# EAGLE design datalogger (EAGLE 9.6.2)
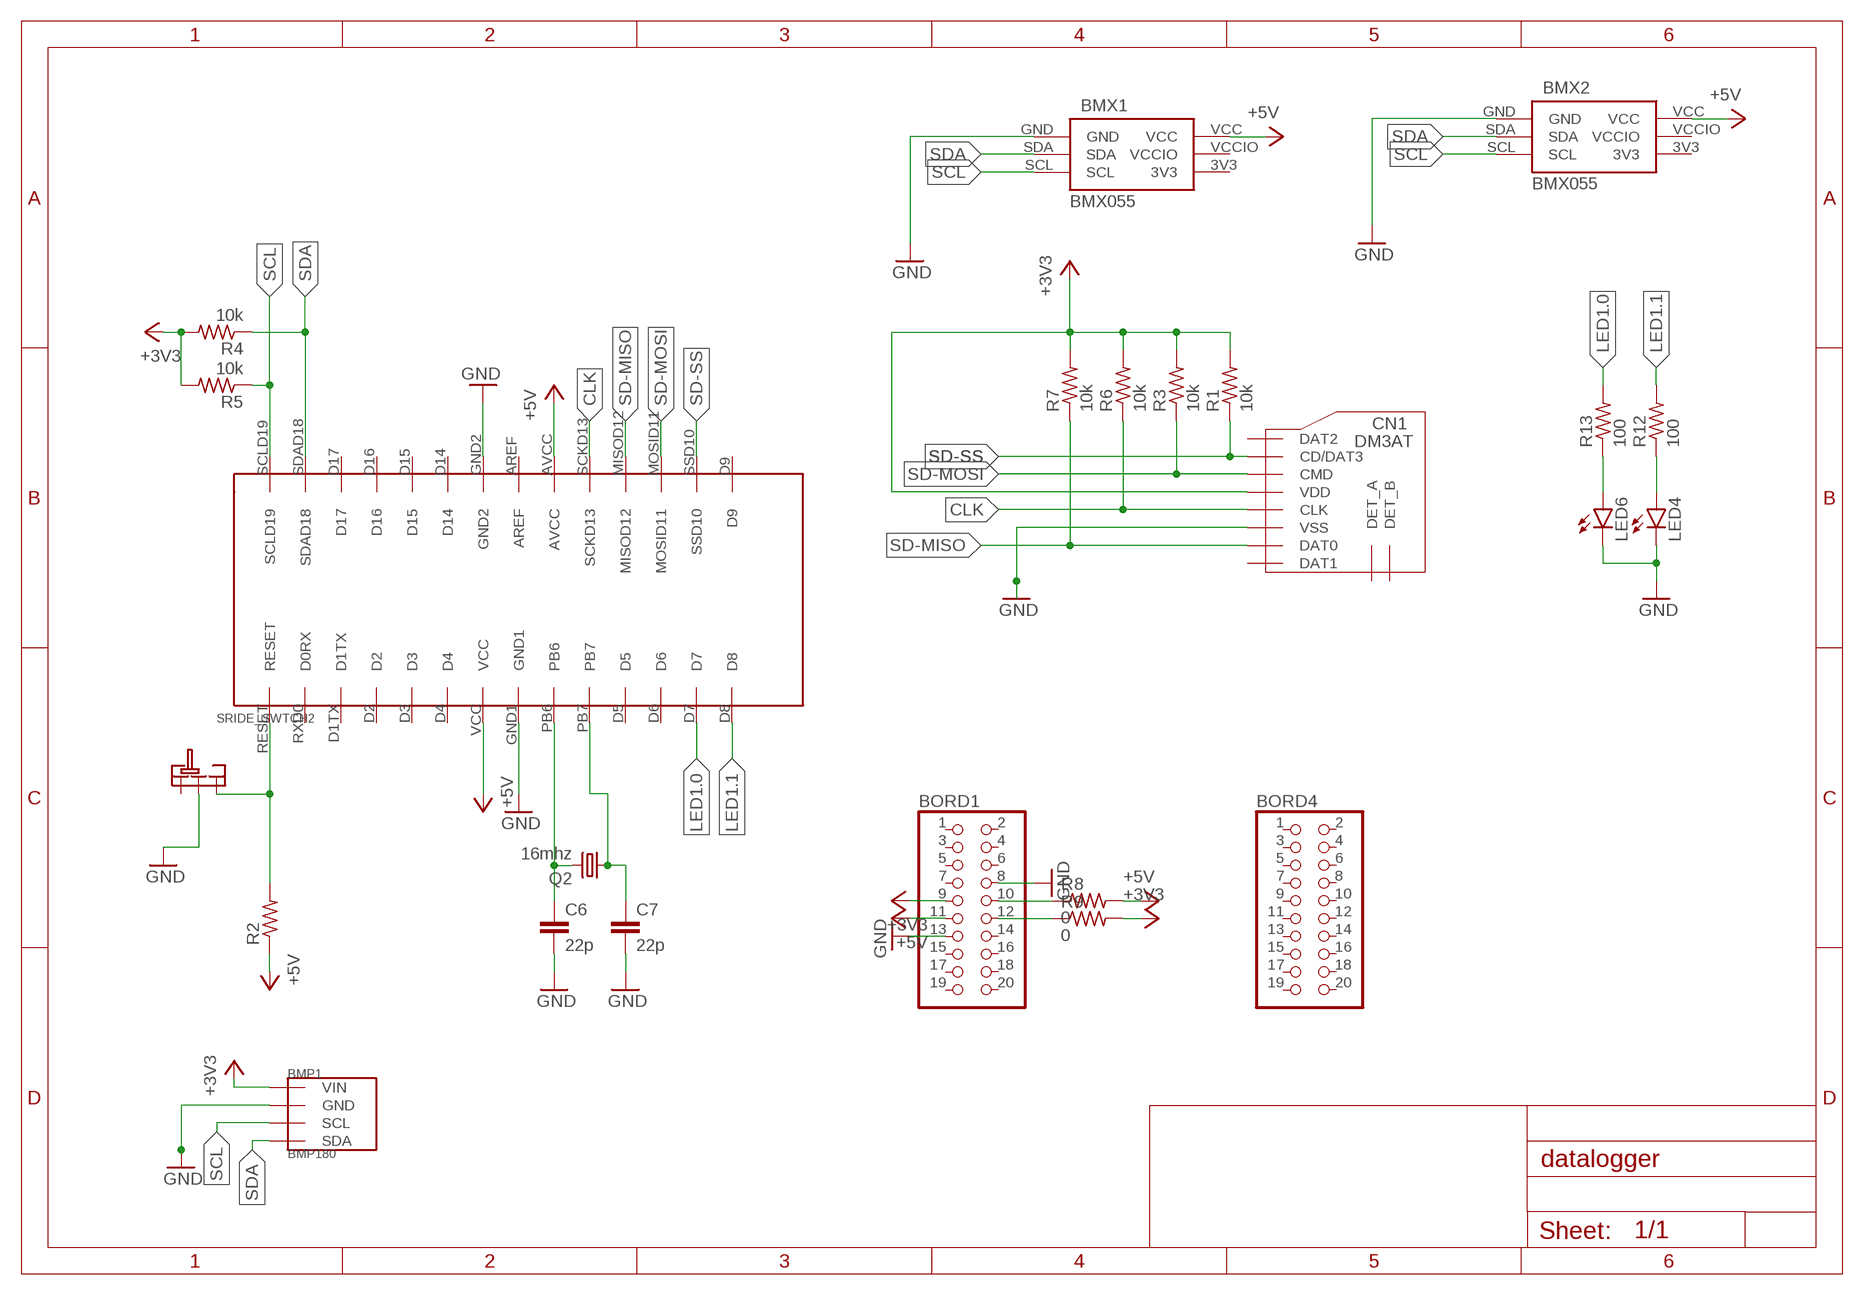
[diagram p0: schematic, sheet 1]

## Parts
BMP1  BMP180  [GY-68]
BMX1  BMX055  [BMX055]
BMX2  BMX055  [BMX055]
BORD1  PINHD-2X10/90  [2X10/90]
BORD4  PINHD-2X10/90  [2X10/90]
C6  22p  C-EU025-024X044  [C025-024X044]
C7  22p  C-EU025-024X044  [C025-024X044]
CN1  DM3AT  [DM3AT]
LED4  LED5MM  [LED5MM]
LED6  LED5MM  [LED5MM]
Q2  16mhz  CRYSTALHC49S  [HC49/S]
R1  10k  R-US_0204/7  [0204/7]
R2  R-US_0204/7  [0204/7]
R3  10k  R-US_0204/7  [0204/7]
R4  10k  R-US_0204/7  [0204/7]
R5  10k  R-US_0204/7  [0204/7]
R6  10k  R-US_0204/7  [0204/7]
R7  10k  R-US_0204/7  [0204/7]
R8  0  R-US_0204/7  [0204/7]
R9  0  R-US_0204/7  [0204/7]
R12  100  R-US_0204/7  [0204/7]
R13  100  R-US_0204/7  [0204/7]
SRIDE_SWTCH2  SRIDE_SWITCH  [SRIDE_SWITCH]
U$6  ATMEGA238P  [ATMEGA328P]

## Nets
+3V3 [POWER_L]: BMP1.P1(VIN) BORD1.9 CN1.VDD R1.2 R3.2 R4.2 R5.2 R6.2 R7.2 R9.2
+5V [POWER_H]: BMX1.VCC BMX2.VCC BORD1.11 R2.1 R8.2 U$6.AVCC U$6.VCC
CLK [SIGNAL]: CN1.CLK R6.1 U$6.SCKD13
GND [GND]: BMP1.P2(GND) BMX1.GND BMX2.GND BORD1.8 BORD1.13 C6.2 C7.2 CN1.VSS LED4.K(C) LED6.K(C) SRIDE_SWTCH2.LR U$6.GND1 U$6.GND2
LED1.0 [SIGNAL]: R13.2 U$6.D7
LED1.1 [SIGNAL]: R12.2 U$6.D8
N$1 [SIGNAL]: LED6.A R13.1
N$2 [SIGNAL]: C6.1 Q2.2 U$6.PB6
N$4 [SIGNAL]: C7.1 Q2.1 U$6.PB7
N$6 [SIGNAL]: BORD1.10 R8.1
N$7 [SIGNAL]: LED4.A R12.1
N$8 [SIGNAL]: R2.2 SRIDE_SWTCH2.R U$6.RESET
N$9 [SIGNAL]: BORD1.12 R9.1
SCL [SIGNAL]: BMP1.P3(SCL) BMX1.SCL BMX2.SCL R5.1 U$6.SCLD19
SD-MISO [SIGNAL]: CN1.DAT0 R7.1 U$6.MISOD12
SD-MOSI [SIGNAL]: CN1.CMD R3.1 U$6.MOSID11
SD-SS [SIGNAL]: CN1.CD/DAT3 R1.1 U$6.SSD10
SDA [SIGNAL]: BMP1.P4(SDA) BMX1.SDA BMX2.SDA R4.1 U$6.SDAD18
Unconnected: BORD1.1 BORD1.2 BORD1.3 BORD1.4 BORD1.5 BORD1.6 BORD1.7 BORD1.14 BORD1.15 BORD1.16 BORD1.17 BORD1.18 BORD1.19 BORD1.20 BORD4.1 BORD4.2 BORD4.3 BORD4.4 BORD4.5 BORD4.6 BORD4.7 BORD4.8 BORD4.9 BORD4.10 BORD4.11 BORD4.12 BORD4.13 BORD4.14 BORD4.15 BORD4.16 BORD4.17 BORD4.18 BORD4.19 BORD4.20 CN1.DAT1 CN1.DAT2 CN1.DET_A CN1.DET_B SRIDE_SWTCH2.L U$6.AREF U$6.D1TX U$6.D2 U$6.D3 U$6.D4 U$6.D5 U$6.D6 U$6.D9 U$6.D14 U$6.D15 U$6.D16 U$6.D17 U$6.RXD0(D0RX)

## Power pins joined to a net without a drawn wire
3V3: BMX1.3V3 BMX2.3V3
VCCIO: BMX1.VCCIO BMX2.VCCIO

## Library data of the parts
BMP1 = BMP180:BMP180
BMX1 BMX2 = BMX055:BMX055
BORD1 BORD4 = pinhead:PINHD-2X10: PIN HEADER
C6 C7 = rcl:C-EU: CAPACITOR, European symbol; SPICEPREFIX: C
CN1 = microSD:DM3AT
LED4 LED6 = led:LED: LED OSRAM: - CHIPLED LG R971, LG N971, LY N971, LG Q971, LY Q971, LO R971, LY R971 LH N974, LH R974 LS Q976, LO Q976, LY Q976 LO Q996 - Hyper CHIPLED LW Q18S LB Q993, LB Q99A, LB R99A - SideLED LS A670, LO A670, LY A670, LG A670, LP A670 LB A673, LV A673, LT A673, LW A673 LH A674 LY A675 LS A676, LA A676, LO A676, LY A676, LW A676 LS A679, LY A679, LG A679 - Hyper Micro SIDELED® LS Y876, LA Y876, LO Y876, LY Y876 LT Y87S - SmartLED LW L88C, LW L88S LB L89C, LB L89S, LG L890 LS L89K, LO L89K, LY L89K LS L896, LA L896, LO L896, LY L896 - TOPLED LS T670, LO T670, LY T670, LG T670, LP T670 LSG T670, LSP T670, LSY T670, LOP T670, LYG T670 LG T671, LOG T671, LSG T671 LB T673, LV T673, LT T673, LW T673 LH T674 LS T676, LA T676, LO T676, LY T676, LB T676, LH T676, LSB T676, LW T676 LB T67C, LV T67C, LT T67C, LS T67K, LO T67K, LY T67K, LW E67C LS E67B, LA E67B, LO E67B, LY E67B, LB E67C, LV E67C, LT E67C LW T67C LS T679, LY T679, LG T679 LS T770, LO T770, LY T770, LG T770, LP T770 LB T773, LV T773, LT T773, LW T773 LH T774 LS E675, LA E675, LY E675, LS T675 LS T776, LA T776, LO T776, LY T776, LB T776 LHGB T686 LT T68C, LB T68C - Hyper Mini TOPLED® LB M676 - Mini TOPLED Santana® LG M470 LS M47K, LO M47K, LY M47K Source: http://www.osram.convergy.de LUXEON: - LUMILED® LXK2-PW12-R00, LXK2-PW12-S00, LXK2-PW14-U00, LXK2-PW14-V00 LXK2-PM12-R00, LXK2-PM12-S00, LXK2-PM14-U00 LXK2-PE12-Q00, LXK2-PE12-R00, LXK2-PE12-S00, LXK2-PE14-T00, LXK2-PE14-U00 LXK2-PB12-K00, LXK2-PB12-L00, LXK2-PB12-M00, LXK2-PB14-N00, LXK2-PB14-P00, LXK2-PB14-Q00 LXK2-PR12-L00, LXK2-PR12-M00, LXK2-PR14-Q00, LXK2-PR14-R00 LXK2-PD12-Q00, LXK2-PD12-R00, LXK2-PD12-S00 LXK2-PH12-R00, LXK2-PH12-S00 LXK2-PL12-P00, LXK2-PL12-Q00, LXK2-PL12-R00 Source: www.luxeon.com KINGBRIGHT: KA-3528ASYC Source: www.kingbright.com
Q2 = crystal:CRYSTAL: CRYSTAL; OC_FARNELL: 1667008; OC_NEWARK: unknown
R1-R9 R12 R13 = rcl:R-US_: RESISTOR, American symbol; SPICEPREFIX: R
SRIDE_SWTCH2 = Sride Switch:SRIDE_SWITCH
U$6 = atmega328p:ATMEGA238P

## Net classes
1 SIGNAL: width 0.152 mm, drill 0.152 mm, clearance 0.152 mm
2 POWER_H: width 0.457 mm, drill 0.152 mm, clearance 0.152 mm
3 POWER_L: width 0.305 mm, drill 0.152 mm, clearance 0.152 mm
4 GND: width 0.305 mm, drill 0.152 mm, clearance 0.152 mm

## Board
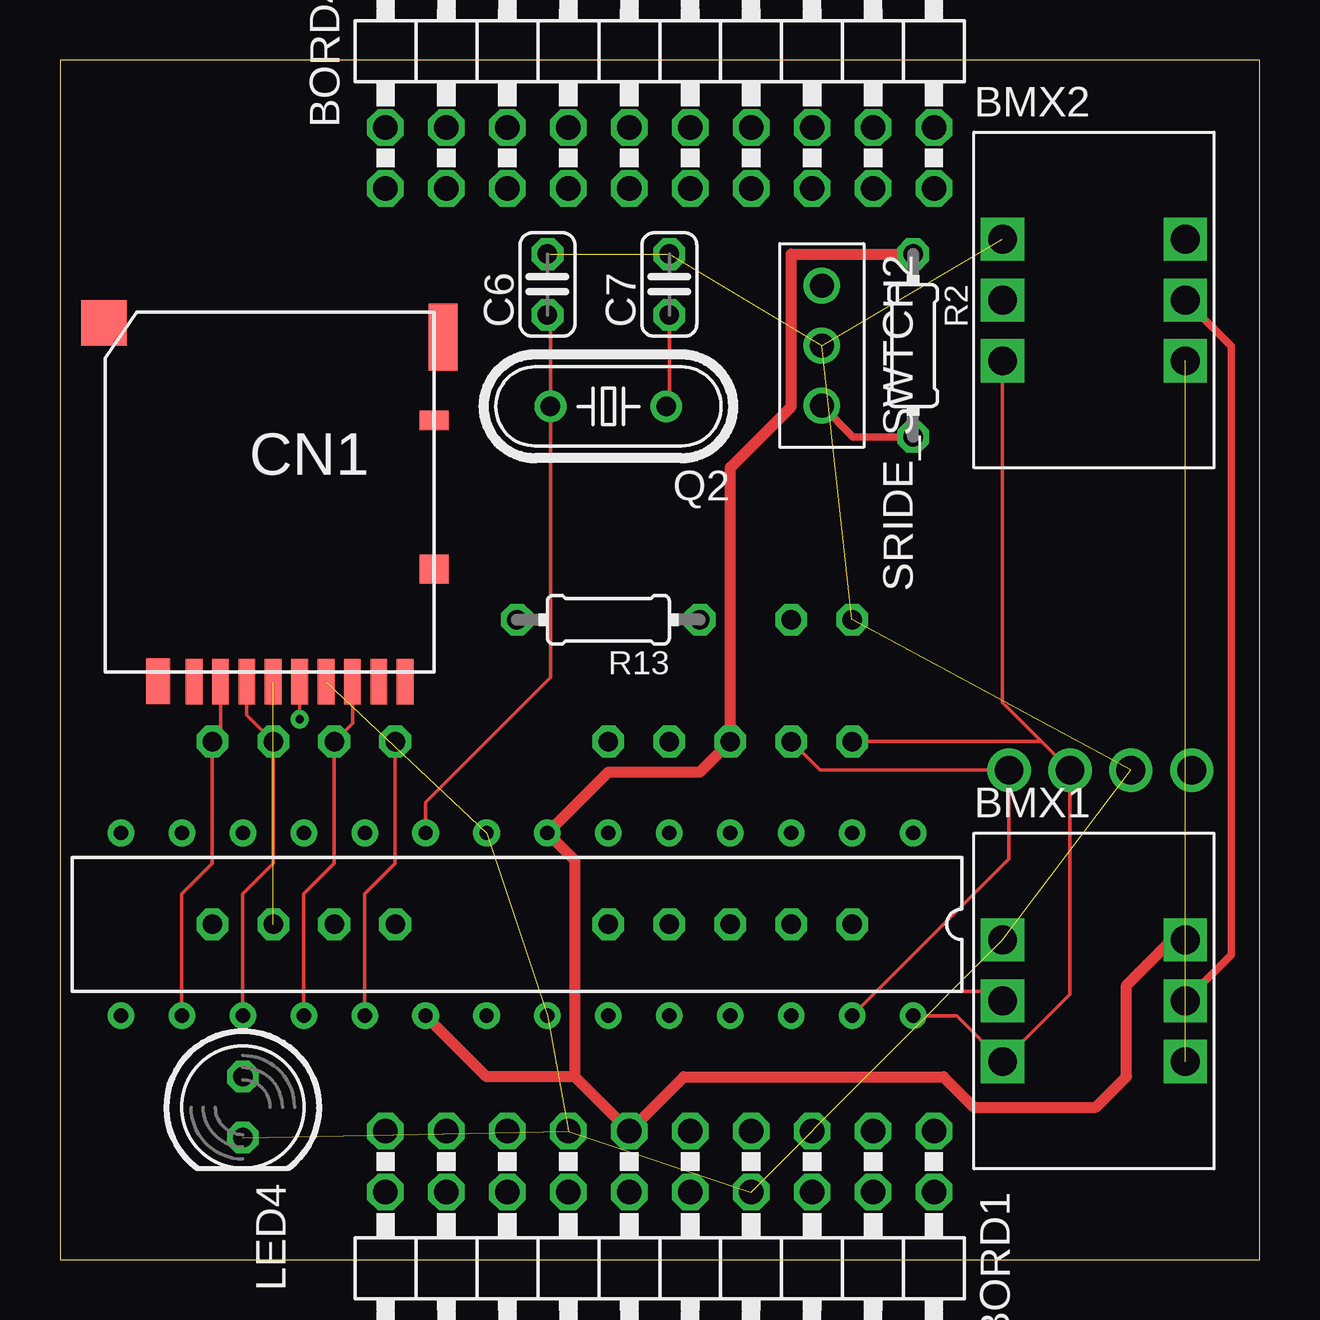
[diagram p1: board, top side]
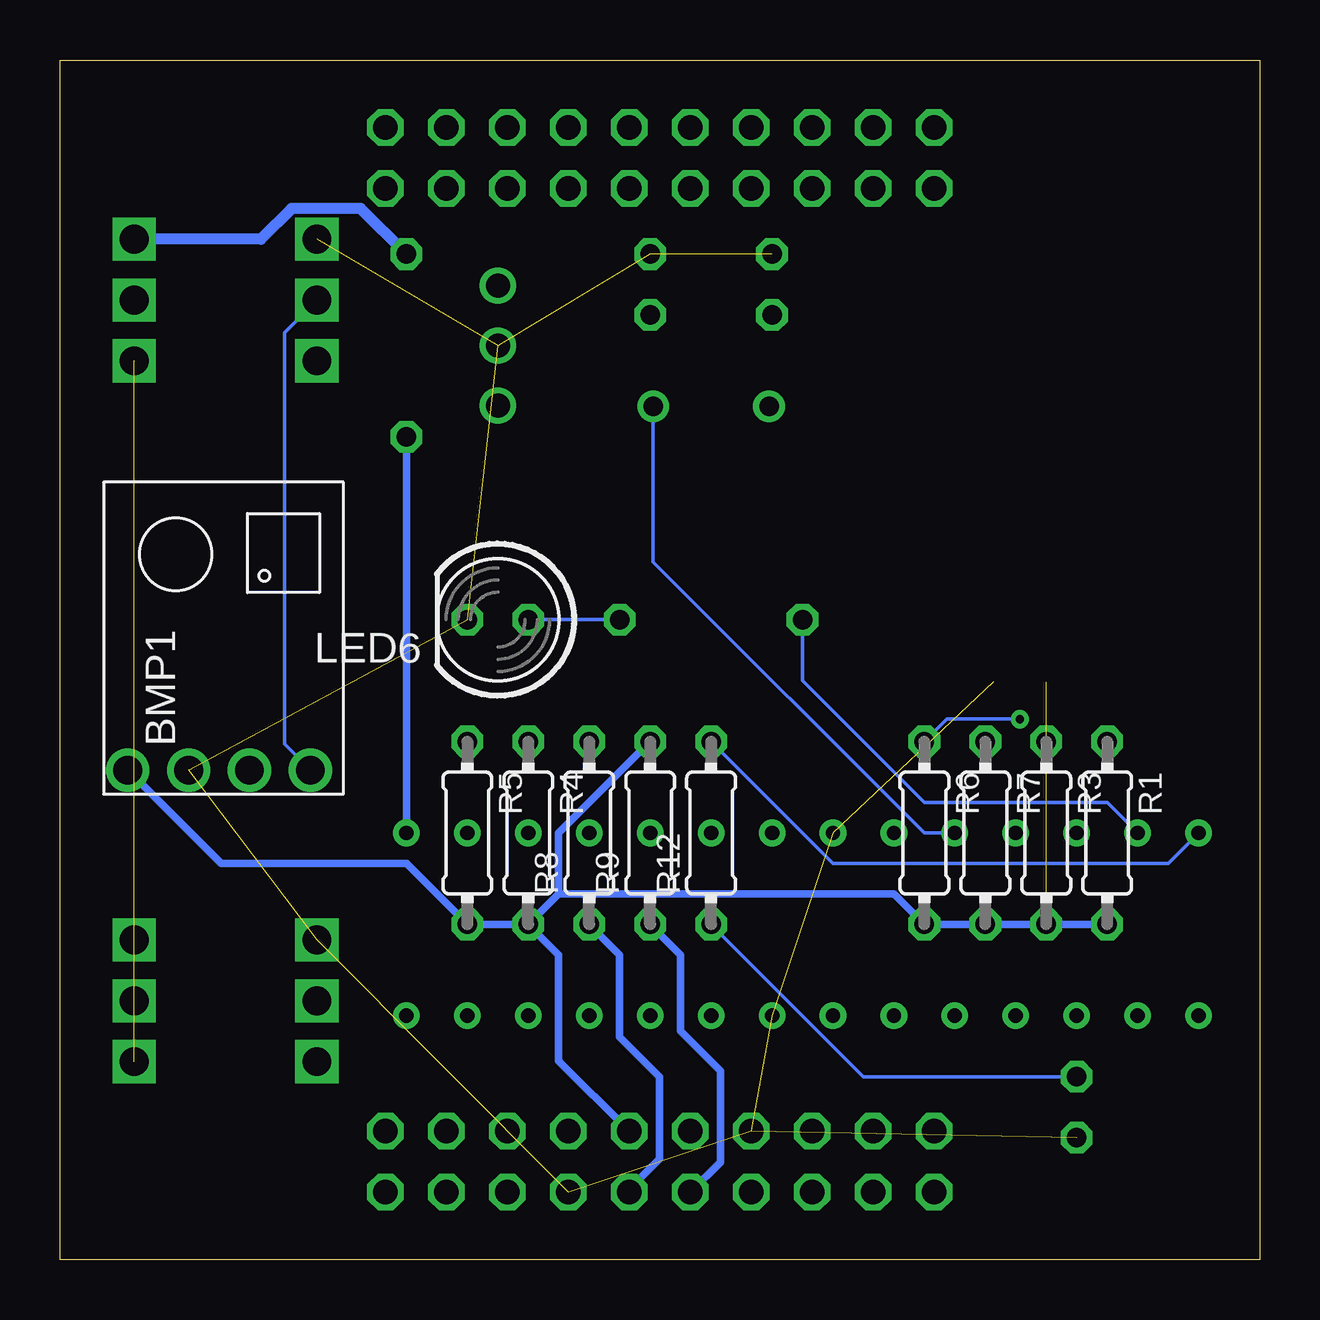
[diagram p2: board, bottom side, seen from below]

Size 50 x 50 mm. Coordinates in mm from the lower left corner, seen from the top.
Outline: 0,0 50,0 50,50 0,50 0,0
Copper layers (1*16): Top 0.035mm / dielectric 1.5mm / Bottom 0.035mm
Design rules "default": minimum track width 6mil, minimum drill 0.35mm, track to track 6mil, track to pad 6mil, pad to pad 6mil, via to via 6mil, smd to smd 6mil, copper to edge 40mil, drill to drill 6mil, minimum pad ring 10mil, minimum via ring 8mil, stop-mask expansion 4mil, vias tented up to drill 0mil, thermal gap 10mil

### Footprints (pad centres in the part's own frame; a part is rotated, then mirrored left to right if it is on the bottom)
GY-68 = drill 1.2: P1 -5,4; P2 -5,1.46; P3 -5,-1.08; P4 -5,-3.62
BMX055 = drill 1.2 pad 1.5 square: 3V3 8.81,-9.53; GND 1.19,-4.46; SCL 1.19,-9.53; SDA 1.19,-7; VCC 8.81,-4.46; VCCIO 8.81,-7
2X10/90 = drill 1.016 octagon: 1 -11.43,-6.35; 2 -11.43,-3.81; 3 -8.89,-6.35; 4 -8.89,-3.81; 5 -6.35,-6.35; 6 -6.35,-3.81; 7 -3.81,-6.35; 8 -3.81,-3.81; 9 -1.27,-6.35; 10 -1.27,-3.81; 11 1.27,-6.35; 12 1.27,-3.81; 13 3.81,-6.35; 14 3.81,-3.81; 15 6.35,-6.35; 16 6.35,-3.81; 17 8.89,-6.35; 18 8.89,-3.81; 19 11.43,-6.35; 20 11.43,-3.81
C025-024X044 = drill 0.813 octagon: 1 -1.27,0; 2 1.27,0
DM3AT = smd 0.7 x 1.9: CD/DAT3 2.2,6.4; CLK -1.1,6.4; CMD 1.1,6.4; DAT0 -3.3,6.4; DAT1 -4.4,6.4; DAT2 3.3,6.4; DET_B -5.5,6.4; VDD 0,6.4; VSS -2.2,6.4 | smd 1.2 x 0.8: DET_A -6.7,-4.5 | smd 1 x 1.9: P$9 4.8,6.381 | smd 1.2 x 1.2: P$11 -6.7,1.7 | smd 1.2 x 2.8: P$13 -7.081,-7.973 | smd 1.9 x 1.9: P$14 7.054,-8.562
LED5MM = drill 0.813 octagon: A -1.27,0; K 1.27,0
HC49/S = drill 0.813: 1 -2.413,0; 2 2.413,0
0204/7 = drill 0.813 octagon: 1 -3.81,0; 2 3.81,0
SRIDE_SWITCH = drill 1: L -2.5,0; LR 0,0; R 2.5,0
ATMEGA328P = drill 0.6: AREF 17.78,7.62; AVCC 20.32,7.62; D1TX 5.08,0; D2 7.62,0; D3 10.16,0; D4 12.7,0; D5 25.4,0; D6 27.94,0; D7 30.48,0; D8 33.02,0; D9 33.02,7.62; D14 12.7,7.62; D15 10.16,7.62; D16 7.62,7.62; D17 5.08,7.62; GND1 17.78,0; GND2 15.24,7.62; MISOD12 25.4,7.62; MOSID11 27.94,7.62; PB6 20.32,0; PB7 22.86,0; RESET 0,0; RXD0 2.54,0; SCKD13 22.86,7.62; SCLD19 0,7.62; SDAD18 2.54,7.62; SSD10 30.48,7.62; VCC 15.24,0

### Placement (x,y rotation side)
BMP1  43.18,25.4 90 bottom
BMX1  38.1,17.78 0 top
BMX2  38.1,46.99 0 top
BORD1  25,-1 180 top
BORD4  25,51 0 top
C6  20.32,40.64 90 top
C7  25.4,40.64 90 top
CN1  8.89,30.48 180 top
LED4  7.62,6.35 270 top
LED6  31.75,26.67 180 bottom
Q2  22.86,35.56 180 top
R1  6.35,17.78 270 bottom
R2  35.56,38.1 270 top
R3  8.89,17.78 270 bottom
R4  30.48,17.78 270 bottom
R5  33.02,17.78 270 bottom
R6  13.97,17.78 270 bottom
R7  11.43,17.78 270 bottom
R8  27.94,17.78 90 bottom
R9  25.4,17.78 90 bottom
R12  22.86,17.78 90 bottom
R13  22.86,26.67 180 top
SRIDE_SWTCH2  31.75,38.1 270 top
U$6  35.56,17.78 180 top

### Tracks (layer width: path | path; a pad name or v marks a point on that pad's centre or on a via)
3V3  (1 unrouted)
+3V3  (1 unrouted)
  Bottom 0.305: R4.2 R5.2 35.56,16.51 43.29,16.51 BMP1.P1 | BORD1.9 29.21,8.29 29.21,12.7 R4.2 | R9.2 29.21,17.78 29.21,15.24 | 29.21,15.24 R4.2 | R1.2 R3.2 R7.2 R6.2 15.24,15.24 29.21,15.24
+5V
  Top 0.457: 21.46,7.62 BORD1.11 26,7.62 36.83,7.62 38.1,6.35 43.18,6.35 44.45,7.62 44.45,11.43 46.34,13.32 BMX1.VCC | 21.46,7.62 17.78,7.62 U$6.AVCC | 21.46,7.62 21.46,16.51 21.46,16.64 U$6.VCC 22.86,20.32 26.67,20.32 R8.2 27.94,33.02 30.48,35.56 30.48,41.91 R2.1
  Bottom 0.457: BMX2.VCC 41.63,42.53 40.35,43.81 37.46,43.81 R2.1
CLK  (via drill 0.35)
  Top 0.152: U$6.SCKD13 12.7,15.24 13.97,16.51 R6.1 | 10.16,23.91 CN1.CLK v9.99,22.52
  Bottom 0.152: v9.99,22.52 13.04,22.52 R6.1
GND  (12 unrouted)
LED1.0
  Bottom 0.152: U$6.D7 6.35,19.05 13.97,19.05 19.05,24.13 R13.2
LED1.1
  Bottom 0.152: U$6.D8 3.81,16.51 17.78,16.51 R12.2
N$1
  Bottom 0.152: R13.1 LED6.A
N$2
  Top 0.152: C6.1 20.45,39.24 Q2.2 20.45,24.26 15.24,19.05 U$6.PB6
N$4
  Top 0.152: C7.1 25.4,35.69 Q2.1
  Bottom 0.152: U$6.PB7 13.97,17.78 25.27,29.08 Q2.1
N$6
  Bottom 0.305: BORD1.10 26.27,2.94 25.02,4.19 25.02,7.62 26.67,9.27 26.67,12.7 R8.1
N$7
  Bottom 0.152: R12.1 16.51,7.62 LED4.A
N$8
  Top 0.305: SRIDE_SWTCH2.R 33.06,34.29 R2.2
  Bottom 0.305: U$6.RESET R2.2
N$9
  Bottom 0.305: BORD1.12 22.48,4.06 22.48,7.87 24.13,9.53 24.13,12.7 R9.1
SCL
  Top 0.152: U$6.SCLD19 37.38,10.16 BMX1.SCL 42.1,11.06 BMP1.P3 40.91,21.59 | R5.1 40.91,21.59 | BMX2.SCL 39.29,23.21 40.91,21.59
SD-MISO
  Top 0.152: CN1.DAT0 12.19,22.35 R7.1 11.43,16.51 10.16,15.24 U$6.MISOD12
SD-MOSI
  Top 0.152: CN1.CMD 7.79,22.69 R3.1 8.89,16.51 7.62,15.24 U$6.MOSID11
SD-SS
  Top 0.152: CN1.CD/DAT3 6.69,21.93 R1.1 6.35,16.51 5.08,15.24 U$6.SSD10
SDA
  Top 0.152: U$6.SDAD18 34.04,11.18 | BMX1.SDA 38.89,11.18 34.04,11.18 | 34.04,11.18 39.56,16.7 BMP1.P4 31.67,20.4 R4.1
  Bottom 0.152: BMX2.SDA 40.64,38.64 40.64,21.48 BMP1.P4
VCCIO
  Top 0.305: BMX1.VCCIO 48.83,12.7 48.83,38.07 BMX2.VCCIO